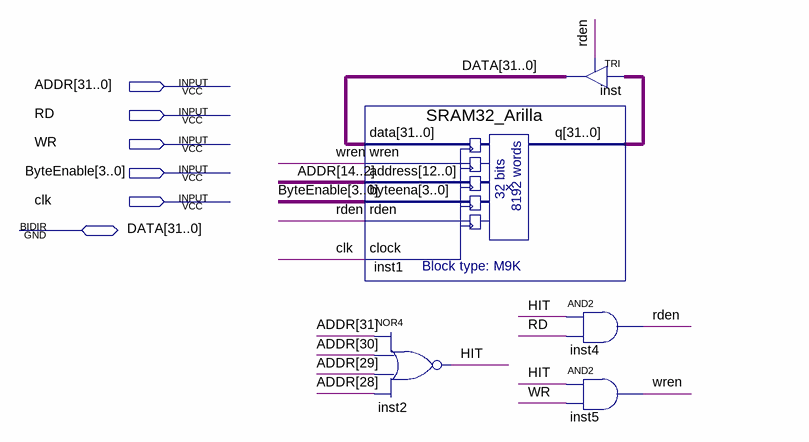
[diagram p0: schematic sheet]
// Quartus schematic SRAMAdapter.bdf as structural Verilog: 5 symbols, 6 pins
module SRAMAdapter (
  input  [31:0] ADDR,
  input  RD,
  input  WR,
  input  [3:0] ByteEnable,
  input  clk,
  inout  [31:0] DATA
);

  wire HIT, rden, wren;
  wire [31:0] inst1_q;

  SRAM32_Arilla inst1 (
    .data(DATA), .wren(wren), .address(ADDR[14:2]), .byteena(ByteEnable), .rden(rden), .clock(clk),
    .q(inst1_q));
  nor inst2 (HIT, ADDR[31], ADDR[30], ADDR[29], ADDR[28]);
  TRI inst[31:0] (.IN(inst1_q), .OE(rden), .OUT(DATA));
  and inst4 (rden, HIT, RD);
  and inst5 (wren, HIT, WR);
endmodule
